# EAGLE design MRCS-Dual-3-Position-Semaphore-Controller v16 (EAGLE 7.7.0)
PCR Clinic board
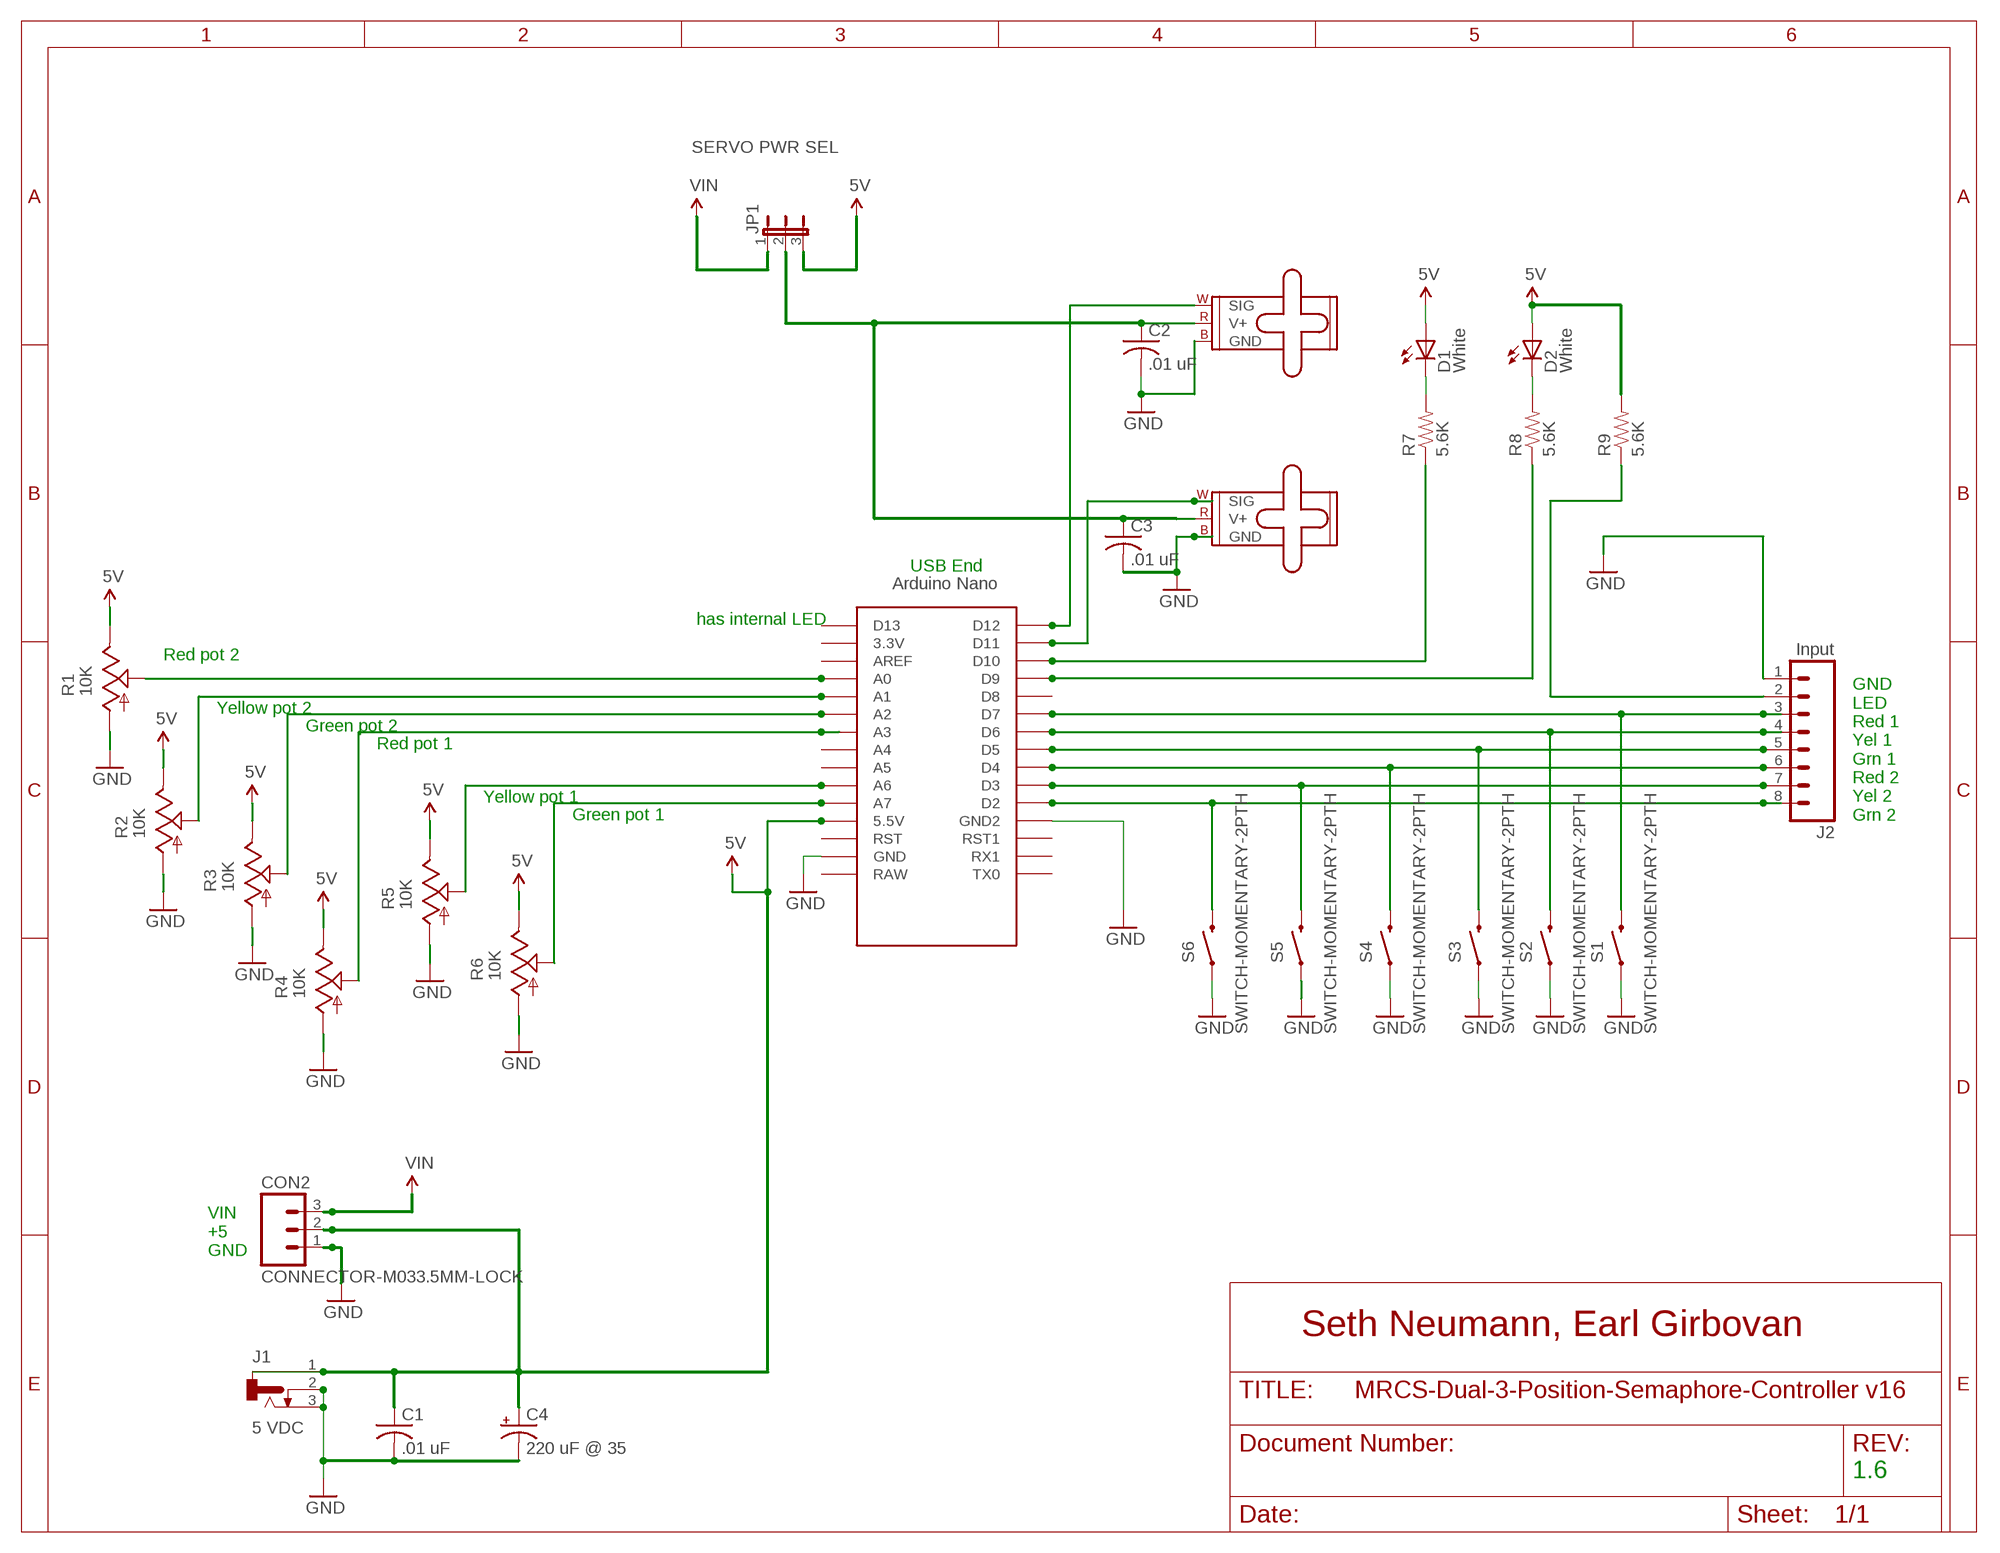
[diagram p0: schematic, sheet 1]

## Parts
C1  .01 uF  CAPPTH1  [C050-024X044]
C2  .01 uF  CAPPTH1  [C050-024X044]
C3  .01 uF  CAPPTH1  [C050-024X044]
C4  220 uF @ 35  CAP-POLPTH-5MM  [E5-10.5]
CON2  CONNECTOR-M033.5MM-LOCK  [SCREWTERMINAL-3.5MM-3_LOCK.007S]
D1  White  LEDLED3MM  [LED3MM]
D2  White  LEDLED3MM  [LED3MM]
J1  5 VDC  CONNECTOR-DC-POWER-RA  [DCJ0202]
J2  Input  CONNECTOR-M08LOCK  [1X08_LOCK]
JP1  SERVO PWR SEL  JUMPER-3PTH-LOCK  [1X03]
M1  SMALL_SERVO  [1X03]
M2  SMALL_SERVO  [1X03]
NANO  NANO  [NANO]
R1  10K  TRIM_US-RS3  [RS3]
R2  10K  TRIM_US-RS3  [RS3]
R3  10K  TRIM_US-RS3  [RS3]
R4  10K  TRIM_US-RS3  [RS3]
R5  10K  TRIM_US-RS3  [RS3]
R6  10K  TRIM_US-RS3  [RS3]
R7  5.6K  RESISTORPTH-1/4W  [AXIAL-0.4]
R8  5.6K  RESISTORPTH-1/4W  [AXIAL-0.4]
R9  5.6K  RESISTORPTH-1/4W  [AXIAL-0.4]
S1  SWITCH-MOMENTARY-2PTH  [TACTILE-PTH]
S2  SWITCH-MOMENTARY-2PTH  [TACTILE-PTH]
S3  SWITCH-MOMENTARY-2PTH  [TACTILE-PTH]
S4  SWITCH-MOMENTARY-2PTH  [TACTILE-PTH]
S5  SWITCH-MOMENTARY-2PTH  [TACTILE-PTH]
S6  SWITCH-MOMENTARY-2PTH  [TACTILE-PTH]

## Nets
5V [Power]: C1.1 C4.+ CON2.2 D1.A D2.A J1.1 JP1.3 NANO.5V(5.5V) R1.E R2.E R3.E R4.E R5.E R6.E R9.P$2
A0: NANO.A0 R1.S
A1: NANO.A1 R2.S
A2: NANO.A2 R3.S
A3: NANO.A3 R4.S
A6: NANO.A6 R5.S
A7: NANO.A7 R6.S
D2: J2.8 NANO.D2 S6.3
D3: J2.7 NANO.D3 S5.3
D4: J2.6 NANO.D4 S4.3
D5: J2.5 NANO.D5 S3.3
D6: J2.4 NANO.D6 S2.3
D7: J2.3 NANO.D7 S1.3
D10: NANO.D10 R7.P$1
D11: M2.1(SIG) NANO.D11
D12: M1.1(SIG) NANO.D12
GND [Power]: C1.2 C2.2 C3.2 C4.- CON2.1 J1.2 J1.3 J2.1 M1.3(GND) M2.3(GND) NANO.GND NANO.GND1(GND2) R1.A R2.A R3.A R4.A R5.A R6.A S1.1 S2.1 S3.1 S4.1 S5.1 S6.1
N$1: J2.2 R9.P$1
N$7: D1.K(C) R7.P$2
N$8: D2.K(C) R8.P$2
N$17: NANO.D9 R8.P$1
SERVO_SUP: C2.1 C3.1 JP1.2 M1.2(V+) M2.2(V+)
VIN: CON2.3 JP1.1
Unconnected: NANO.3.3V NANO.A4 NANO.A5 NANO.AREF NANO.D8 NANO.D13 NANO.RAW NANO.RST NANO.RST1 NANO.RX1 NANO.TX0

## Notes on the sheet
- USB End
- has internal LED
- Red pot 2
- Yellow pot 2
- Green pot 2
- Red pot 1
- Yellow pot 1
- Green pot 1
- GND
  LED
  Red 1
  Yel 1
  Grn 1
  Red 2
  Yel 2
  Grn 2
- VIN
  +5
  GND
- Seth Neumann, Earl Girbovan
- 1.6

## Library data of the parts
C1-C3 = SPCoast:CAP*
C4 = SPCoast:CAP-POL*
CON2 = SPCoast:CONNECTOR-M03
D1 D2 = SPCoast:LED*
J1 = SPCoast:CONNECTOR-DC-POWER: DC POWER JACK Source: DCJ0202.pdf
J2 = SPCoast:CONNECTOR-M08: Header 8 Standard 8-pin 0.1" header. Use with straight break away headers (SKU : PRT-00116), right angle break away headers (PRT-00553), swiss pins (PRT-00743), machine pins (PRT-00117), and female headers (PRT-00115).
JP1 = SPCoast:JUMPER-3
M1 M2 = SparkFun-Electromechanical:SMALL_SERVO: Small servo motor This is the small servo used in the SIK. SKU: ROB-09065
NANO = Arduino-clone-scn:NANO: Arduino Nano
R1-R6 = MRCS:TRIM_US-: POTENTIOMETER
R7-R9 = SparkFun-Resistors:RESISTOR: Resistor Basic schematic elements and footprints for 0603, 1206, and PTH resistors.
S1-S6 = SparkFun-Electromechanical:SWITCH-MOMENTARY-2: Various NO switches- pushbuttons, reed, etc

## Net classes
0 default: width 0.305 mm
1 Power: width 0.61 mm

## Board
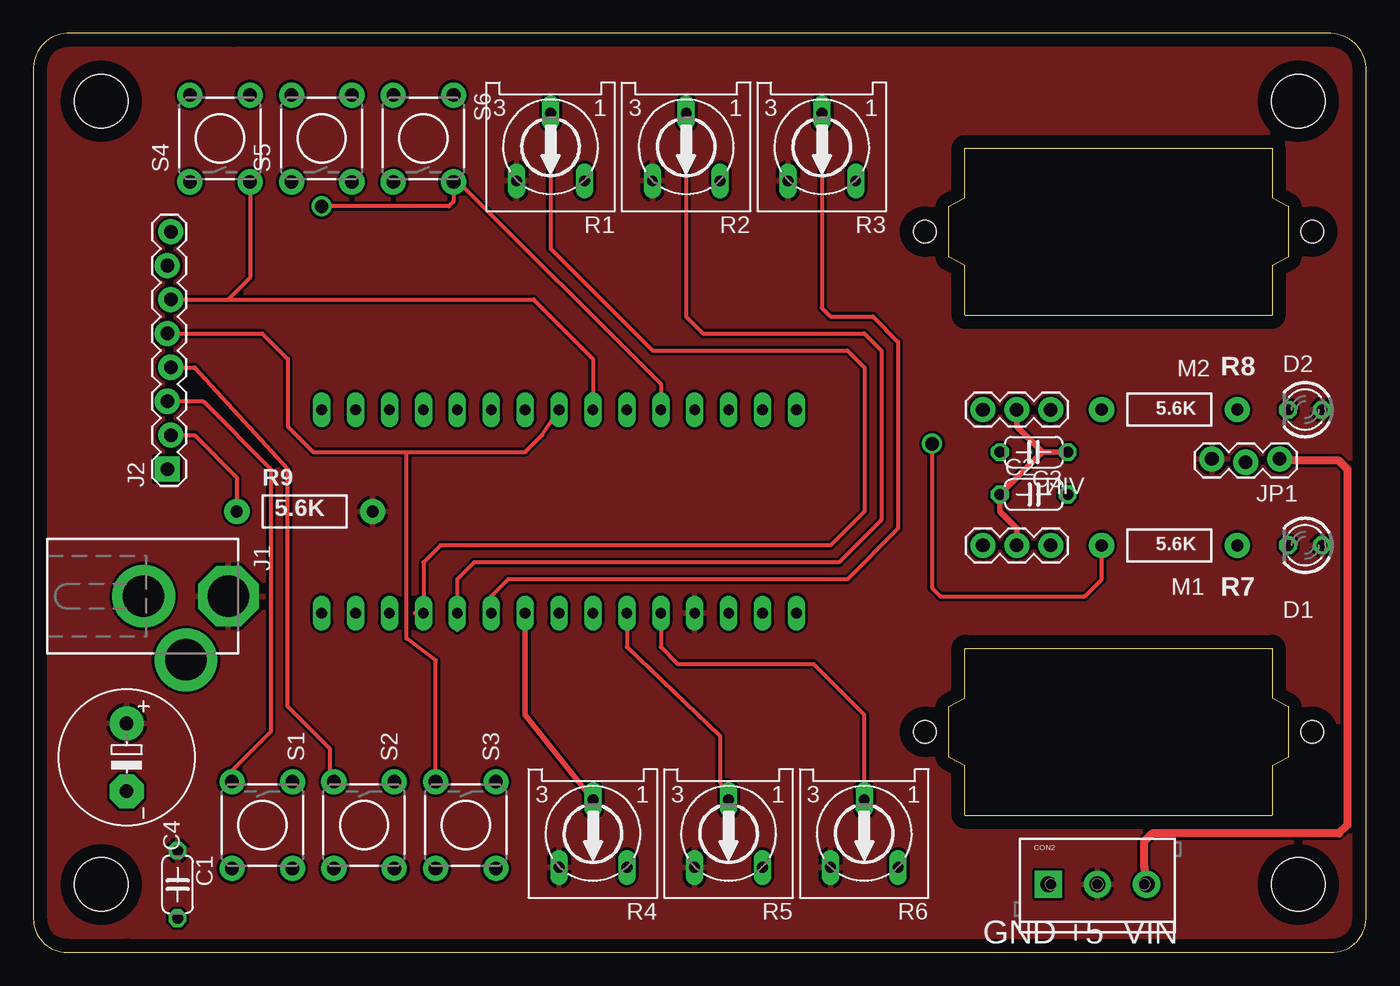
[diagram p1: board, top side]
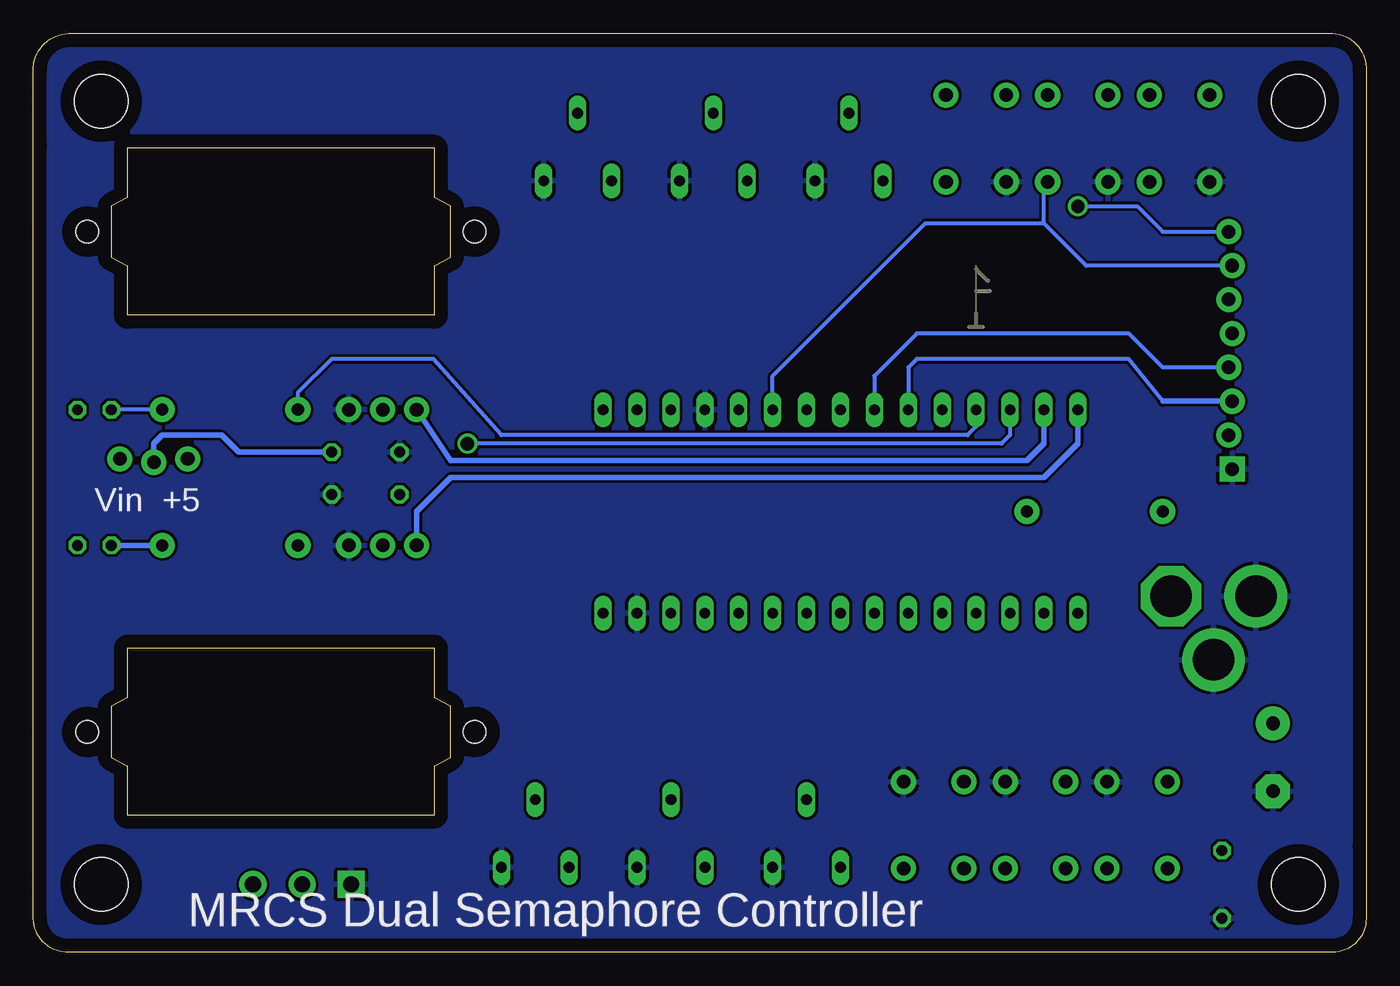
[diagram p2: board, bottom side, seen from below]

Size 99.82 x 68.83 mm. Coordinates in mm from the lower left corner, seen from the top.
Copper layers (1*16): Top 0.035mm / dielectric 1.5mm / Bottom 0.035mm
Design rules "default": minimum track width 10mil, minimum drill 24mil, track to track 8mil, track to pad 8mil, pad to pad 8mil, via to via 8mil, smd to smd 8mil, copper to edge 40mil, drill to drill 8mil, minimum pad ring 10mil, minimum via ring 8mil, stop-mask expansion 4mil, vias tented up to drill 0mil, thermal gap 10mil

### Footprints (pad centres in the part's own frame; a part is rotated, then mirrored left to right if it is on the bottom)
C050-024X044 = drill 0.813 octagon: 1 -2.54,0; 2 2.54,0
E5-10.5 = drill 1.016 pad 2.54: + -2.54,0 | drill 1.016 pad 2.54 octagon: - 2.54,0
SCREWTERMINAL-3.5MM-3_LOCK.007S = drill 1.2 pad 2.032 square: 1 -0.178,0 | drill 1.2 pad 2.032: 2 3.5,0; 3 7.178,0
LED3MM = drill 0.813 octagon: A -1.27,0; K 1.27,0
DCJ0202 = drill 3.1 pad 4.5 octagon: 1 0,3.175 | drill 3.1 pad 4.7: 2 4.763,0; 3 0,-3.175
1X08_LOCK = drill 1.016 pad 1.88 square: 1 0,0.127 | drill 1.016 pad 1.88: 2 2.54,-0.127; 3 5.08,0.127; 4 7.62,-0.127; 5 10.16,0.127; 6 12.7,-0.127; 7 15.24,0.127; 8 17.78,-0.127
1X03 = drill 1.016 pad 1.88: 1 0,-0.127; 2 2.54,0.127; 3 5.08,-0.127
1X03' = drill 1.016 pad 1.88: 1 0,0; 2 2.54,0; 3 5.08,0
NANO = drill 0.8 long: 3.3V -10.16,24.13; 5V -10.16,-1.27; A0 -10.16,19.05; A1 -10.16,16.51; A2 -10.16,13.97; A3 -10.16,11.43; A4 -10.16,8.89; A5 -10.16,6.35; A6 -10.16,3.81; A7 -10.16,1.27; AREF -10.16,21.59; D2 5.08,1.27; D3 5.08,3.81; D4 5.08,6.35; D5 5.08,8.89; D6 5.08,11.43; D7 5.08,13.97; D8 5.08,16.51; D9 5.08,19.05; D10 5.08,21.59; D11 5.08,24.13; D12 5.08,26.67; D13 -10.16,26.67; GND -10.16,-6.35; GND1 5.08,-1.27; RAW -10.16,-8.89; RST -10.16,-3.81; RST1 5.08,-3.81; RX1 5.08,-6.35; TX0 5.08,-8.89
RS3 = drill 0.813 long: A -2.54,2.54; E 2.54,2.54; S 0,-2.54
AXIAL-0.4 = drill 0.9 pad 1.88: P$1 -5.08,0; P$2 5.08,0
TACTILE-PTH = drill 1.016 pad 1.88: 1 -3.251,2.261; 2 3.251,2.261; 3 -3.251,-2.261; 4 3.251,-2.261
BOARD-DINRAIL-2.7IN = hole 4: 94.742,5.08; 5.08,63.754; 94.742,63.754; 5.08,5.08
SERVO-9G = hole 1.7: -14.5,0; 14.5,0

### Placement (x,y rotation side)
C1  10.8,5.08 270 top
C2  74.93,34.29 0 top
C3  74.93,37.47 180 top
C4  6.99,14.61 270 top
CON2  76.2,5.08 0 top
D1  95.25,30.48 180 top
D2  95.25,40.64 180 top
J1  11.43,26.67 270 top
J2  10.16,36.2 90 top
JP1  93.35,36.83 180 top
M1  SMALL_SERVO  [1X03']  71.12,30.48 0 top
M2  SMALL_SERVO  [1X03']  71.12,40.64 0 top
NANO  48.26,35.56 90 top
R1  38.74,60.33 180 top
R2  48.9,60.33 180 top
R3  59.06,60.33 180 top
R4  41.91,8.89 180 top
R5  52.07,8.89 180 top
R6  62.23,8.89 180 top
R7  85.09,30.48 0 top
R8  85.09,40.64 0 top
R9  20.32,33.02 0 top
S1  17.15,9.53 270 top
S2  24.77,9.53 270 top
S3  32.39,9.53 270 top
S4  13.97,60.96 90 top
S5  21.59,60.96 90 top
S6  29.21,60.96 90 top
U$1  [BOARD-DINRAIL-2.7IN]  0,0 0 top
U$2  [SERVO-9G]  81.28,16.51 180 top
U$3  [MRCSLOGOBTM]  22.86,46.35 0 top
U$4  [SERVO-9G]  81.28,53.98 180 top
U$5  [CA-PROP65WARNING]  52.71,30.48 0 top

### Tracks (layer width: path | path; a pad name or v marks a point on that pad's centre or on a via)
5V
  pour Top: 0,68.58 100.33,68.58 100.33,0 0,0
A0
  Top 0.305: R1.S 38.74,52.7 46.36,45.09 60.96,45.09 62.23,43.81 62.23,33.02 59.69,30.48 30.48,30.48 29.21,29.21 29.21,26.04 28.58,25.4 NANO.A0
A1
  Top 0.305: 31.75,24.13 NANO.A1 31.75,27.94 33.02,29.21 60.33,29.21 63.5,32.38 63.5,45.09 62.23,46.35 50.17,46.35 48.9,47.62 R2.S
A2
  Top 0.305: R3.S 59.06,48.26 59.69,47.62 62.87,47.62 64.77,45.72 64.77,31.75 60.96,27.94 35.56,27.94 34.29,26.67 NANO.A2
A3
  Top 0.406: NANO.A3 36.83,17.78 R4.S
A6
  Top 0.305: 52.07,12.7 52.07,12.06 | 52.07,12.06 R5.S | NANO.A6 44.45,22.86 51.44,16.19 51.44,12.7 52.07,12.06
A7
  Top 0.305: NANO.A7 46.99,22.86 48.26,21.59 58.42,21.59 62.23,17.78 R6.S
D2  (via drill 1 pad 0.81)
  Top 0.305: NANO.D2 46.99,42.55 31.83,57.71 S6.3 31.47,56.24 31.12,55.88 v21.59,55.88
  Bottom 0.305: v21.59,55.88 17.15,55.88 15.24,53.98 J2.8
D3
  Bottom 0.305: J2.7 20.96,51.44 24.13,54.61 | 24.13,54.61 24.13,57.43 S5.3 | NANO.D3 44.45,43.18 33.02,54.61 24.13,54.61
D4
  Top 0.305: J2.6 14.61,48.9 | 14.61,48.9 37.47,48.9 41.91,44.45 NANO.D4 | S4.3 16.23,50.52 14.61,48.9
D5
  Top 0.305: S3.3 30.13,21.87 27.94,23.5 27.94,37.47 | 27.94,37.47 20.96,37.47 19.05,39.37 19.05,44.45 17.15,46.35 J2.5 | 27.94,37.47 36.83,37.47 38.1,38.73 NANO.D5
D6
  Top 0.305: J2.4 12.07,43.81 19.05,36.2 19.05,18.41 22.23,15.24 22.23,13.06 S2.3
  Bottom 0.305: J2.4 15.24,43.81 17.78,46.35 33.66,46.35 36.83,43.18 NANO.D6 36.83,40.01
D7
  Top 0.305: J2.3 12.7,41.27 17.78,36.2 17.78,16.51 14.89,13.61 S1.3
  Bottom 0.305: 15.24,41.27 17.78,44.45 33.66,44.45 34.29,43.81 NANO.D7
  Bottom 0.406: J2.3 15.24,41.27
D10  (via drill 1 pad 0.81)
  Top 0.305: v67.31,38.1 67.31,27.3 67.95,26.67 78.74,26.67 80.01,27.94 R7.P$1
  Bottom 0.305: NANO.D10 26.67,38.73 27.31,38.1 v67.31,38.1
D11
  Bottom 0.406: M2.1 68.58,36.83 25.4,36.83 24.13,38.1 NANO.D11
D12
  Bottom 0.406: NANO.D12 21.59,38.1 24.13,35.56 68.58,35.56 71.12,33.02 M1.1
GND
  pour Bottom: 0,68.58 100.33,68.58 100.33,0 0,0
N$1
  Top 0.305: J2.2 12.07,38.73 15.24,35.56 R9.P$1
N$7
  Bottom 0.406: R7.P$2 D1.K
N$8
  Bottom 0.305: R8.P$2 D2.K
N$17
  Bottom 0.305: NANO.D9 29.21,39.37 29.85,38.73 64.77,38.73 69.85,44.45 77.47,44.45 80.01,41.91 R8.P$1
SERVO_SUP
  Top 0.406: M1.2 73.66,31.75 72.39,33.02 C2.1 75.57,37.47 | M2.2 73.66,39.37 75.57,37.47 | 75.57,37.47 C3.1
  Bottom 0.406: C3.1 84.46,37.47 85.73,38.73 90.17,38.73 90.81,38.1 JP1.2
VIN
  Top 0.61: CON2.3 83.19,6.54 83.19,8.26 83.82,8.89 97.79,8.89 98.43,9.53 98.43,36.2 97.79,36.83 93.47,36.83 JP1.1

### Text on the board
tPlace: VIN | GND +5 VIN
bPlace: +5 | Vin | MRCS Dual Semaphore Controller
tDocu: Seth Neumann / Earl Girbovan | V1.6 20250527 | RED | YEL | GRN | RED | YEL | GRN | USB | GN2 / YL2 / RD2 / GR1 / YL1 / RD1 / LED / GND | Arduino Nano | RED | YEL | GRN | RED | YEL | GRN
bDocu: Solder Side | BRN / / ORN